# EAGLE design CS4244 (EAGLE 9.6.2)
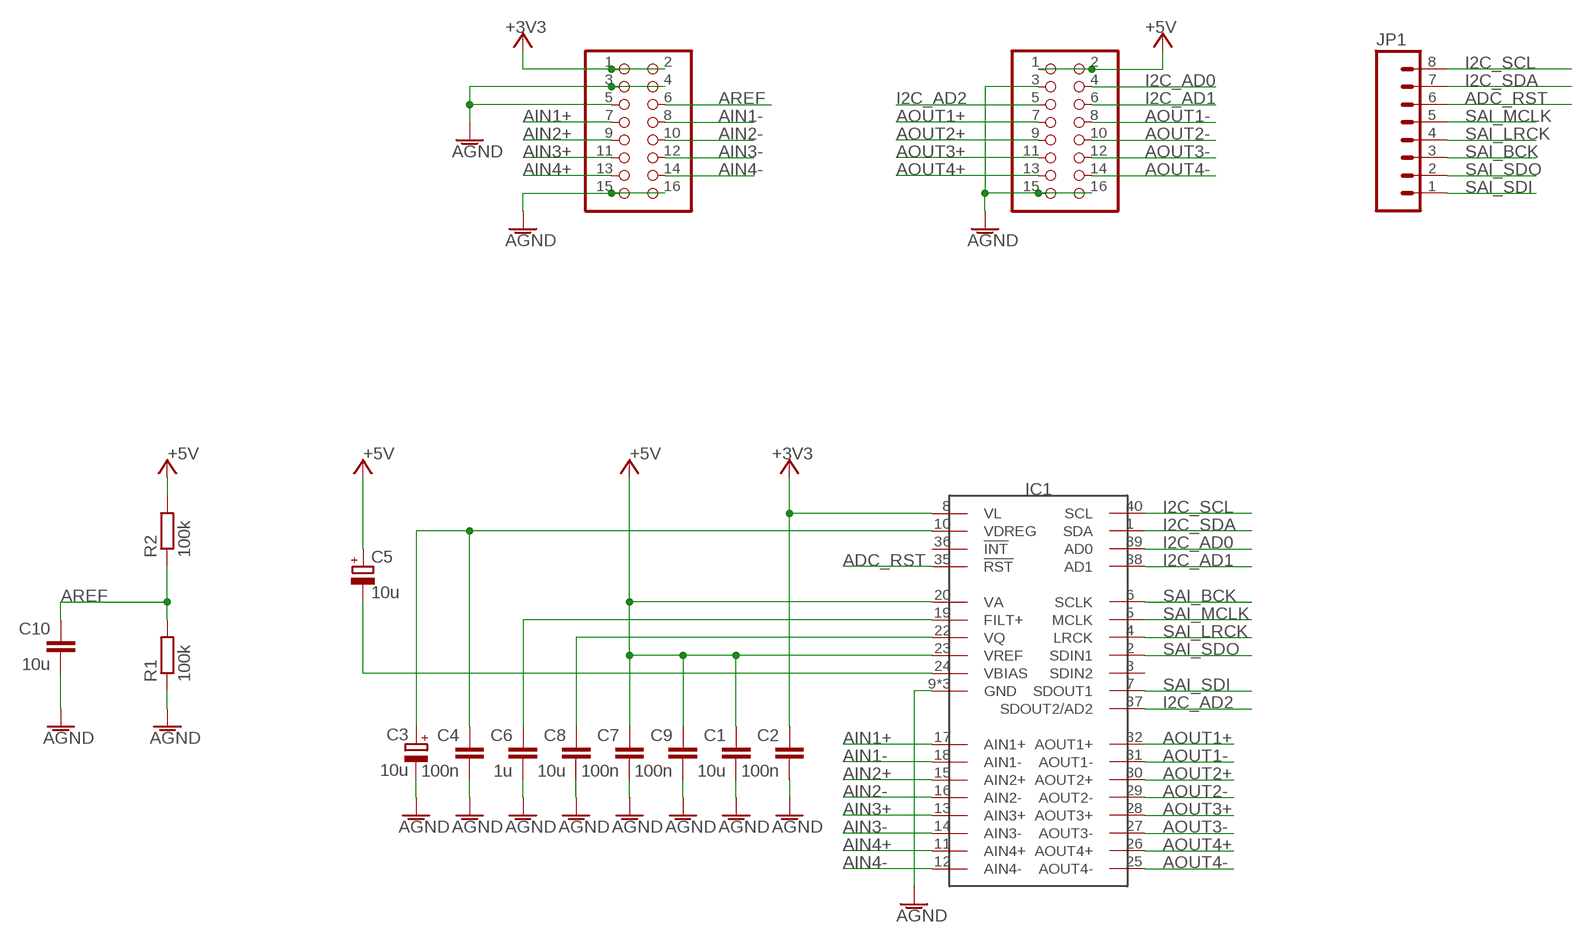
[diagram p0: schematic, sheet 1]

## Parts
C1  10u  C-EUC0603  [C0603]
C2  100n  C-EUC0603  [C0603]
C3  10u  CPOL-EUUD-4X5,8  [UD-4X5,8_NICHICON]
C4  100n  C-EUC0603  [C0603]
C5  10u  CPOL-EUUD-4X5,8  [UD-4X5,8_NICHICON]
C6  1u  C-EUC0603  [C0603]
C7  100n  C-EUC0603  [C0603]
C8  10u  C-EUC0603  [C0603]
C9  100n  C-EUC0603  [C0603]
C10  10u  C-EUC0603  [C0603]
IC1  CS4244  [QFN50P600X600X100-41N]
JP1  M081X08  [1X08]
JP2  PINHD-2X8  [2X08]
JP3  PINHD-2X8  [2X08]
R1  100k  R-EU_R0603  [0603]
R2  100k  R-EU_R0603  [0603]

## Nets
+3V3: C2.1 IC1.8(VL) JP2.1 JP2.2
+5V: C1.1 C5.+ C7.1 C9.1 IC1.20(VA) IC1.23(VREF) JP3.1 JP3.2 R2.2 ; supply symbol labelled +A5V
ADC_RST: IC1.35(!RST) JP1.6
AGND: C1.2 C2.2 C3.- C4.2 C6.2 C7.2 C8.2 C9.2 C10.2 IC1.9(GND) IC1.21(GND) IC1.41(GND) JP2.3 JP2.4 JP2.5 JP2.15 JP2.16 JP3.3 JP3.15 JP3.16 R1.1
AIN1+: IC1.17(AIN1+) JP2.7
AIN1-: IC1.18(AIN1-) JP2.8
AIN2+: IC1.15(AIN2+) JP2.9
AIN2-: IC1.16(AIN2-) JP2.10
AIN3+: IC1.13(AIN3+) JP2.11
AIN3-: IC1.14(AIN3-) JP2.12
AIN4+: IC1.11(AIN4+) JP2.13
AIN4-: IC1.12(AIN4-) JP2.14
AOUT1+: IC1.32(AOUT1+) JP3.7
AOUT1-: IC1.31(AOUT1-) JP3.8
AOUT2+: IC1.30(AOUT2+) JP3.9
AOUT2-: IC1.29(AOUT2-) JP3.10
AOUT3+: IC1.28(AOUT3+) JP3.11
AOUT3-: IC1.27(AOUT3-) JP3.12
AOUT4+: IC1.26(AOUT4+) JP3.13
AOUT4-: IC1.25(AOUT4-) JP3.14
AREF: C10.1 JP2.6 R1.2 R2.1
I2C_AD0: IC1.39(AD0) JP3.4
I2C_AD1: IC1.38(AD1) JP3.6
I2C_AD2: IC1.37(SDOUT2/AD2) JP3.5
I2C_SCL: IC1.40(SCL) JP1.8
I2C_SDA: IC1.1(SDA) JP1.7
N$2: C5.- IC1.24(VBIAS)
N$3: C3.+ C4.1 IC1.10(VDREG)
N$4: C6.1 IC1.19(FILT+)
N$5: C8.1 IC1.22(VQ)
SAI_BCK: IC1.6(SCLK) JP1.3
SAI_LRCK: IC1.4(LRCK) JP1.4
SAI_MCLK: IC1.5(MCLK) JP1.5
SAI_SDI: IC1.7(SDOUT1) JP1.1
SAI_SDO: IC1.2(SDIN1) JP1.2
Unconnected: IC1.3(SDIN2) IC1.36(!INT)

## Library data of the parts
C1 C2 C4 C6-C10 = Rebel:C-EU: CAPACITOR, European symbol
C3 C5 = Rebel:CPOL-EU: POLARIZED CAPACITOR, European symbol
IC1 = CS4244:CS4244: The CS4244 is a 4 in / 4 out Audio CODEC with PCM and TDM interface
JP1 = SparkFun:M08: Header 8 Standard 8-pin 0.1" header. Use with straight break away headers (SKU : PRT-00116), right angle break away headers (PRT-00553), swiss pins (PRT-00743), machine pins (PRT-00117), and female headers (PRT-00115).
JP2 JP3 = pinhead:PINHD-2X8: PIN HEADER
R1 R2 = Rebel:R-EU_: RESISTOR, European symbol

## Net classes
1 power: width 0.178 mm, drill 0.305 mm, clearance 0.178 mm to class 0, clearance 0.178 mm

## Board
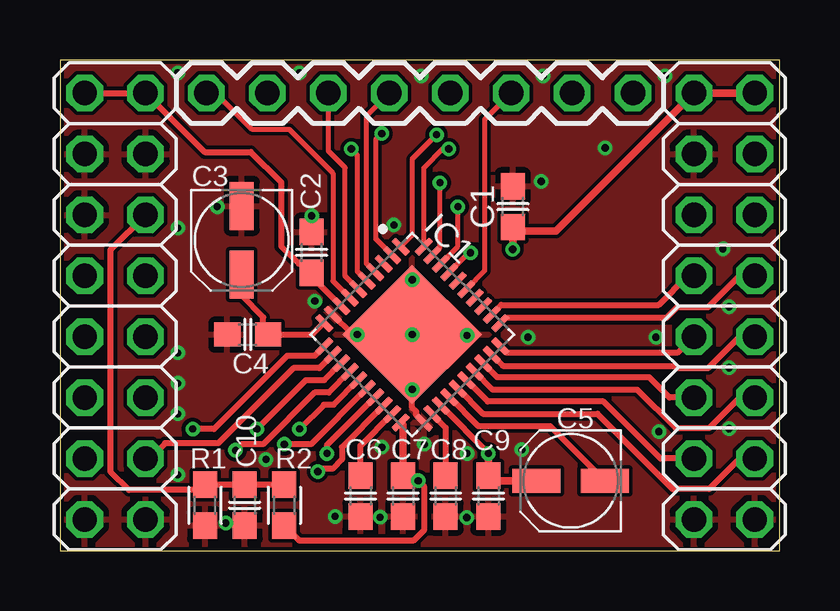
[diagram p1: board, top side]
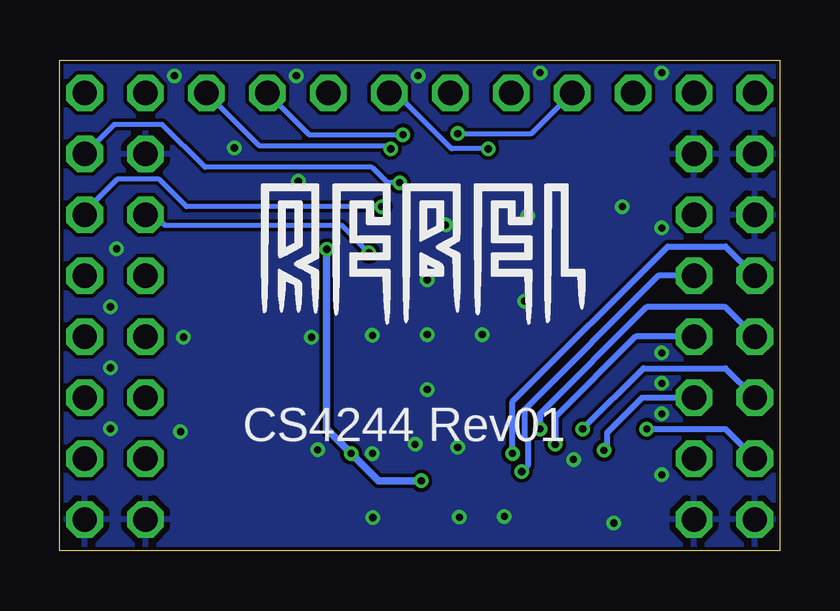
[diagram p2: board, bottom side, seen from below]

Size 30 x 20.47 mm. Coordinates in mm from the lower left corner, seen from the top.
Outline: 0,0 30,0 30,20.47 0,20.47 0,0
Copper layers (1*16): Top 0.035mm / dielectric 1.5mm / Bottom 0.035mm
Design rules "SparkFun-2-layer-PCBWay-LIMIT": minimum track width 6mil, minimum drill 0.3mm, track to track 6mil, track to pad 6mil, pad to pad 6mil, via to via 6mil, smd to smd 0mil, copper to edge 6mil, drill to drill 6mil, minimum pad ring 6mil, minimum via ring 6mil, stop-mask expansion 4mil, vias tented up to drill 25mil, thermal gap 10mil

### Footprints (pad centres in the part's own frame; a part is rotated, then mirrored left to right if it is on the bottom)
C0603 = smd 1.1 x 1: 1 -0.85,0; 2 0.85,0
UD-4X5,8_NICHICON = smd 2 x 1: + 1.425,0; - -1.425,0
QFN50P600X600X100-41N = smd 0.84 x 0.26: 1 -2.935,2.25; 2 -2.935,1.75; 3 -2.935,1.25; 4 -2.935,0.75; 5 -2.935,0.25; 6 -2.935,-0.25; 7 -2.935,-0.75; 8 -2.935,-1.25; 9 -2.935,-1.75; 10 -2.935,-2.25; 21 2.935,-2.25; 22 2.935,-1.75; 23 2.935,-1.25; 24 2.935,-0.75; 25 2.935,-0.25; 26 2.935,0.25; 27 2.935,0.75; 28 2.935,1.25; 29 2.935,1.75; 30 2.935,2.25 | smd 0.26 x 0.84: 11 -2.25,-2.935; 12 -1.75,-2.935; 13 -1.25,-2.935; 14 -0.75,-2.935; 15 -0.25,-2.935; 16 0.25,-2.935; 17 0.75,-2.935; 18 1.25,-2.935; 19 1.75,-2.935; 20 2.25,-2.935; 31 2.25,2.935; 32 1.75,2.935; 33 1.25,2.935; 34 0.75,2.935; 35 0.25,2.935; 36 -0.25,2.935; 37 -0.75,2.935; 38 -1.25,2.935; 39 -1.75,2.935; 40 -2.25,2.935 | smd 4.1 x 4.1: 41 0,0
1X08 = drill 1.016 octagon: 1 0,0; 2 2.54,0; 3 5.08,0; 4 7.62,0; 5 10.16,0; 6 12.7,0; 7 15.24,0; 8 17.78,0
2X08 = drill 1.016 octagon: 1 -8.89,-1.27; 2 -8.89,1.27; 3 -6.35,-1.27; 4 -6.35,1.27; 5 -3.81,-1.27; 6 -3.81,1.27; 7 -1.27,-1.27; 8 -1.27,1.27; 9 1.27,-1.27; 10 1.27,1.27; 11 3.81,-1.27; 12 3.81,1.27; 13 6.35,-1.27; 14 6.35,1.27; 15 8.89,-1.27; 16 8.89,1.27
0603 = smd 1.1 x 1: 1 -0.85,0; 2 0.85,0

### Placement (x,y rotation side)
C1  18.88,14.35 90 top
C2  10.49,12.45 90 top
C3  7.57,12.95 270 top
C4  7.83,9.02 180 top
C5  21.29,2.92 180 top
C6  12.53,2.29 270 top
C7  14.3,2.29 270 top
C8  16.08,2.29 270 top
C9  17.86,2.29 270 top
C10  7.7,1.91 270 top
IC1  14.69,9.02 315 top
JP1  6.11,19.09 0 top
JP2  2.3,10.2 270 top
JP3  27.7,10.2 270 top
R1  6.05,1.91 90 top
R2  9.35,1.91 270 top

### Tracks (layer width: path | path; a pad name or v marks a point on that pad's centre or on a via)
+3V3
  Top 0.254: JP2.1 JP2.2 6.03,16.64 7.96,16.64 9.22,15.37 9.22,12.7 9.95,11.98 10.11,11.98 C2.1 10.49,11.44 IC1.8
+5V  (via drill 0.3)
  Top 0.254: IC1.20 14.3,5.25 | v17.86,4.07 IC1.23 | C1.1 18.88,13.33 | R2.2 9.99,0.42 14.73,0.42 15.19,0.88 15.19,2.67 v14.94,2.92
  Top 0.305: 14.3,5.25 C7.1 14.72,3.14 v14.94,2.92 | v18.88,12.57 18.88,13.33 20.67,13.33 JP3.1 JP3.2 | C9.1 v17.86,4.06 | v17.86,4.07 C9.1 | C9.1 18.08,2.92 C5.+
  Bottom 0.305: v14.94,2.92 16.72,2.92 v17.86,4.06 18.88,5.08 v18.88,12.57
ADC_RST
  Top 0.203: IC1.35 17.71,11.68 17.71,17.99 JP1.6
AGND  (via drill 0.3)
  Top 0.254: 15.19,5.33 IC1.21 14.86,5.67 14.86,5.81 14.69,5.98 v14.69,6.73 | IC1.9 12.21,9.02 v12.4,9.02
  other vias: 16.96,1.38 4.91,8.26 4.91,6.98 14.69,11.3 6.91,1.16 13.35,1.4 27.64,12.59 11.47,1.44 16.97,8.99 20.06,15.4 10.62,10.41 14.69,9.02 4.91,13.46 10.49,13.97 6.56,14.35 15.19,4.45 8.59,3.81 4.91,5.71 13.42,4.32 13.92,13.59 19.51,8.91 24.84,8.91 24.97,4.97 19.26,4.21 4.91,19.94 9.99,19.94 15.07,19.81 20.15,19.81 25.23,19.81 4.91,3.17 27.89,10.18 27.89,7.64 27.89,5.1 16.97,4.06 22.73,16.8
  pour Top: -0.3,23.71 30,23.71 30.22,-1.97 -0.3,-1.91
  pour Bottom: -0.3,22.45 30.01,22.45 30.07,22.45 30.27,-0.7 -0.3,-0.64
AIN1+  (via drill 0.3)
  Top 0.254: IC1.17 11.12,4.39 v11.12,4.07 v11.13,4.06
  Bottom 0.254: v11.13,4.06 11.13,6.22 4.65,12.7 2.26,12.7 JP2.7
AIN1-  (via drill 0.3)
  Top 0.254: IC1.18 11.76,4.32 11.76,3.8 11.38,3.43 10.88,3.43 v10.75,3.3
  Bottom 0.254: JP2.8 5.05,11.47 10.62,5.9 10.62,4.7 10.49,4.57 10.49,3.56 v10.75,3.3
AIN2+  (via drill 0.3)
  Top 0.254: IC1.15 11.41,6.1 11,6.1 v9.99,5.08
  Bottom 0.254: v9.99,5.08 9.99,5.71 5.54,10.16 2.26,10.16 JP2.9
AIN2-  (via drill 0.3)
  Top 0.254: IC1.16 10.47,4.45 v9.35,4.45
  Bottom 0.254: JP2.10 6.01,8.93 9.35,5.59 v9.35,4.45
AIN3+  (via drill 0.3)
  Top 0.254: IC1.13 11.01,7.11 10.24,7.11 v8.21,5.08
  Bottom 0.254: v8.21,5.08 5.67,7.61 2.25,7.61 JP2.11
AIN3-  (via drill 0.3)
  Top 0.254: IC1.14 11.21,6.6 10.62,6.6 8.46,4.45 7.57,4.45 v7.32,4.19
  Bottom 0.254: v7.32,4.19 7.19,4.32 7.19,4.93 5.73,6.39 JP2.12
AIN4+  (via drill 0.3)
  Top 0.254: v5.54,5.08 6.42,5.08 9.47,8.13 10.61,8.13 IC1.11
  Bottom 0.254: JP2.13 2.26,5.08 v5.54,5.08
AIN4-
  Top 0.254: JP2.14 3.74,3.85 4.38,4.49 6.6,4.49 9.73,7.62 10.81,7.62 IC1.12
AOUT1+
  Top 0.254: IC1.32 18.4,10.26 24.96,10.26 26.18,11.47 JP3.7
AOUT1-
  Top 0.254: IC1.31 18.56,9.71 25.29,9.71 25.73,10.16 27.02,10.16 28.34,11.47 JP3.8
AOUT2+
  Top 0.254: IC1.30 18.63,8.26 25.73,8.26 26.41,8.93 JP3.9
AOUT2-
  Top 0.254: IC1.29 18.46,7.71 25.64,7.71 25.73,7.62 27.02,7.62 28.34,8.93 JP3.10
AOUT3+
  Top 0.254: IC1.28 18.23,7.24 24.57,7.24 25.41,6.39 JP3.11
AOUT3-
  Top 0.254: IC1.27 18.03,6.73 24.06,6.73 25.67,5.12 27.06,5.12 28.34,6.39 JP3.12
AOUT4+
  Top 0.254: IC1.26 17.83,6.22 22.66,6.22 25.03,3.85 JP3.13
AOUT4-
  Top 0.254: IC1.25 17.63,5.71 22.41,5.71 25.54,2.58 27.06,2.58 28.34,3.85 JP3.14
AREF
  Top 0.254: R2.1 C10.1 R1.2 6.01,2.75 5.8,2.54 2.88,2.54 2.11,3.3 2.11,12.55 JP2.6
I2C_AD0  (via drill 0.3)
  Top 0.203: IC1.39 15.84,12.65 v15.84,15.36
  Bottom 0.203: v15.84,15.36 16.35,15.36 17,16 23.96,16 25.73,17.78 27.74,17.78 JP3.4
I2C_AD1  (via drill 0.3)
  Top 0.203: IC1.38 16.59,12.69 v16.59,14.35
  Bottom 0.203: v16.59,14.35 24.72,14.35 25.86,15.49 27.61,15.49 28.97,14.14 JP3.6
I2C_AD2  (via drill 0.3)
  Top 0.203: IC1.37 17.04,12.43 v17.12,12.43
  Bottom 0.203: v17.12,12.43 18.27,13.58 25.62,13.58 26.06,14.01 JP3.5
I2C_SCL  (via drill 0.3)
  Top 0.203: IC1.40 15.17,15.98 15.96,16.76 v16.21,16.76
  Bottom 0.203: v16.21,16.76 16.34,16.89 21.69,16.89 JP1.8
I2C_SDA  (via drill 0.3)
  Top 0.203: v15.7,17.35 14.69,16.34 14.69,13.17 IC1.1
  Bottom 0.203: v15.7,17.35 19.61,17.35 JP1.7
N$2
  Top 0.254: IC1.24 17.43,5.21 20.43,5.21 C5.-
N$3
  Top 0.254: IC1.10 10.99,9.5 10.51,9.02 C4.1 8.48,9.22 8.48,9.74 7.57,10.64 C3.+
N$4
  Top 0.254: C6.1 12.53,4.38 IC1.19
N$5
  Top 0.254: IC1.22 16.08,5.14 C8.1
SAI_BCK
  Top 0.203: IC1.6 11.89,11.46 11.89,15.98 11.19,16.68 JP1.3
SAI_LRCK
  Top 0.203: IC1.4 12.78,11.98 12.78,18.14 JP1.4
SAI_MCLK  (via drill 0.3)
  Top 0.203: IC1.5 12.4,11.66 12.4,16.51 v12.15,16.76
  Bottom 0.203: v12.15,16.76 13.67,16.76 16,19.09 JP1.5
SAI_SDI
  Top 0.203: IC1.7 11.38,11.26 11.38,15.75 9.56,17.57 8.01,17.57 6.49,19.09 JP1.1
SAI_SDO  (via drill 0.3)
  Top 0.203: IC1.2 13.16,13.02 13.16,17.15 v13.42,17.4
  Bottom 0.203: v13.42,17.4 10.34,17.4 JP1.2

### Text on the board
bPlace: CS4244 Rev01